# Altium project PCB_Project_IMX7.PrjPCB (part 4 of 9)

## Sheet IMX7S_WIRELESS.SchDoc
size A2
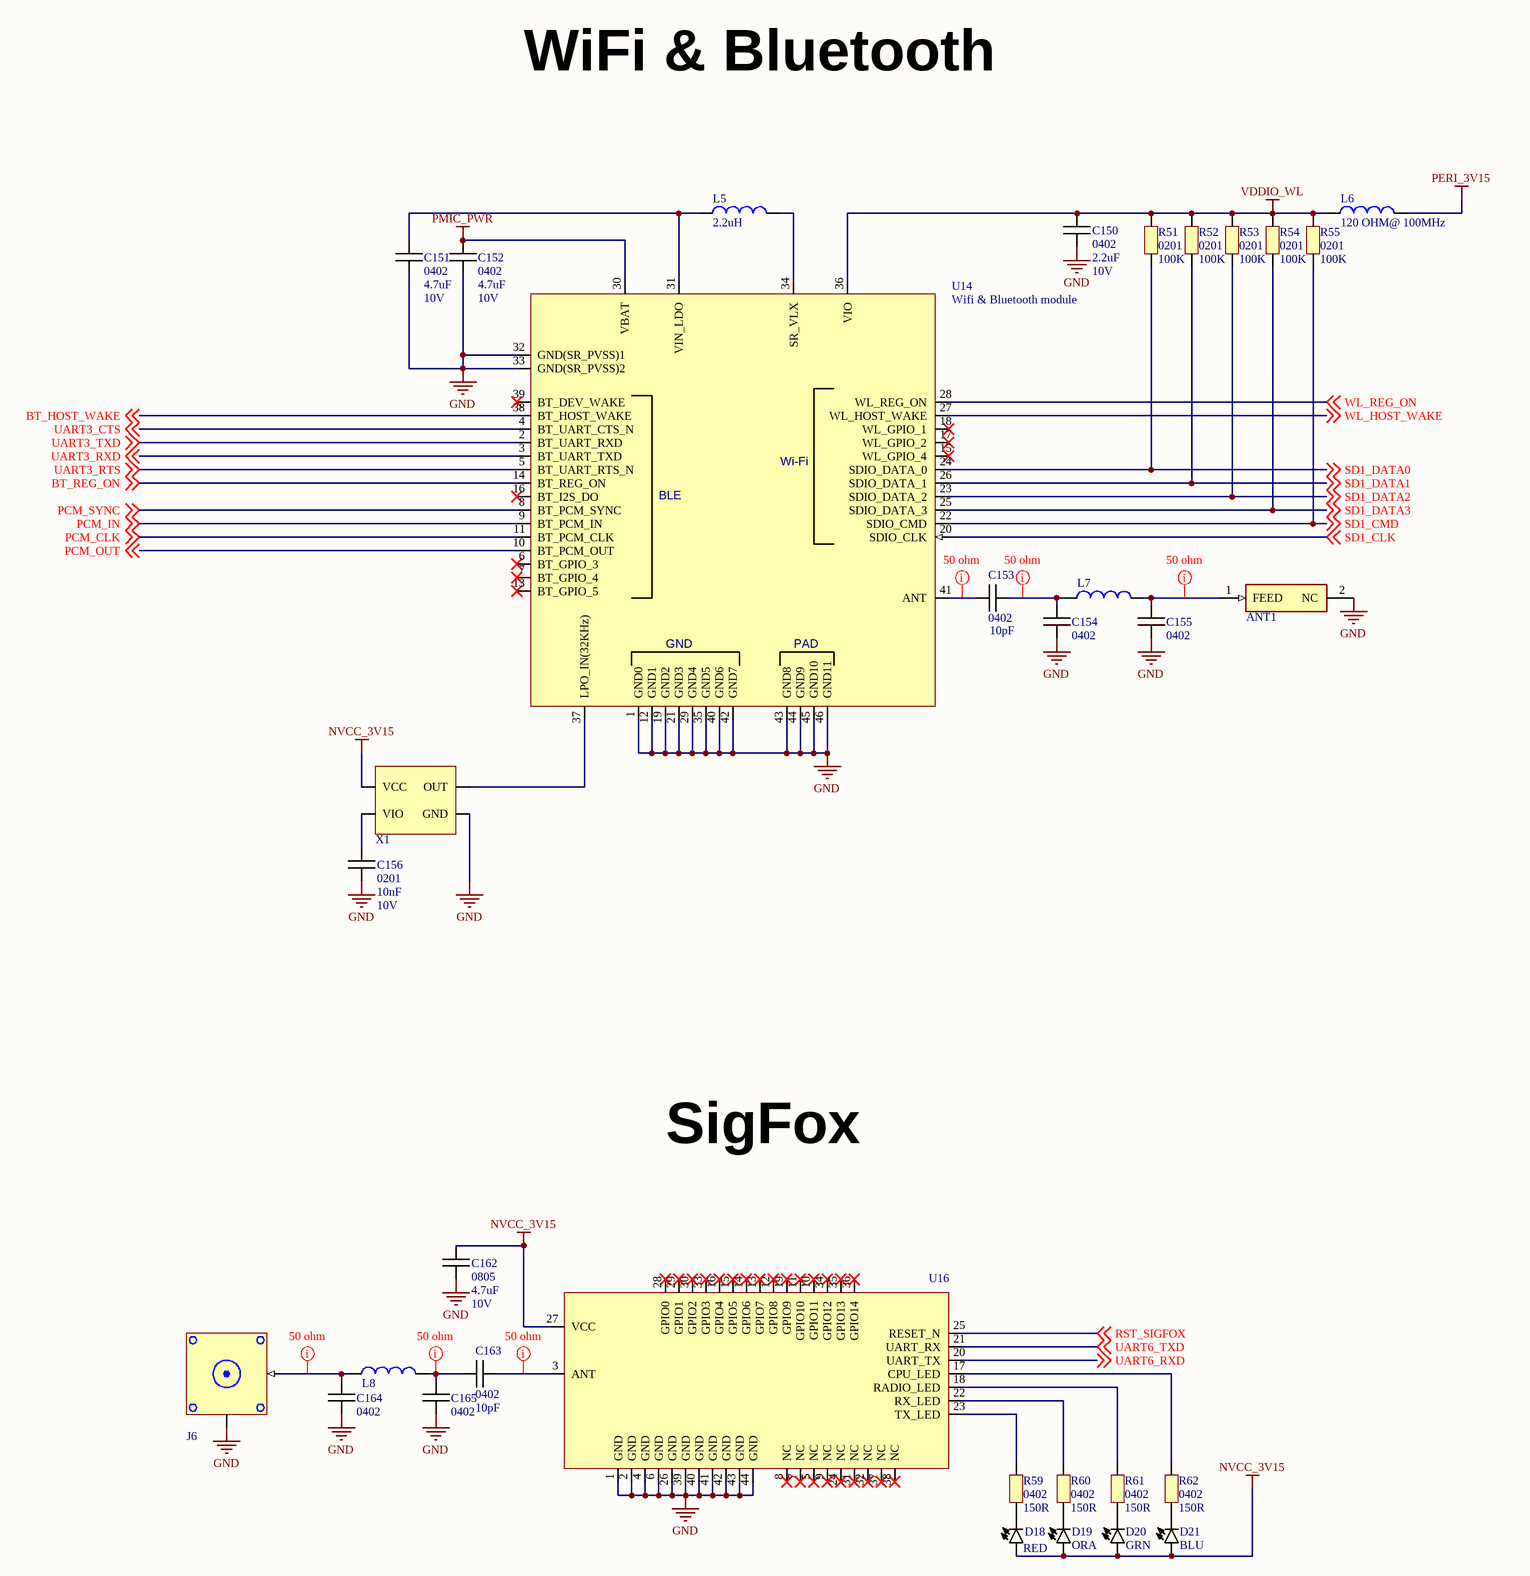
[diagram p6: IMX7S_WIRELESS.SchDoc]

### Parts
ANT1  SRCW004  [SRCW004]  (value not drawn)
C150  value 2.2uF  PACKAGE: 0402  VOLTAGE: 10V  [C0402]  (hidden comment: C0402)
C151  value 4.7uF  PACKAGE: 0402  VOLTAGE: 10V  [C0402]  (hidden comment: C0402)
C152  value 4.7uF  PACKAGE: 0402  VOLTAGE: 10V  [C0402]  (hidden comment: C0402)
C153  value 10pF  PACKAGE: 0402  [C0402]  (hidden comment: C0402)
C154  PACKAGE: 0402  [C0402]  (hidden comment: C0402)
C155  PACKAGE: 0402  [C0402]  (hidden comment: C0402)
C156  value 10nF  PACKAGE: 0201  VOLTAGE: 10V  [C0201]  (hidden comment: C0201)
C162  value 4.7uF  PACKAGE: 0805  VOLTAGE: 10V  [C0805]  (hidden comment: C0805)
C163  value 10pF  PACKAGE: 0402  [C0402]  (hidden comment: C0402)
C164  PACKAGE: 0402  [C0402]  (hidden comment: C0402)
C165  PACKAGE: 0402  [C0402]  (hidden comment: C0402)
D18  RED  [D0603]
D19  ORA  [D0603]
D20  GRN  [D0603]
D21  BLU  [D0603]
J6  SMA  [SMA]  (value not drawn)
L5  value 2.2uH  [R0402]  (hidden comment: Self)
L6  value 120 OHM@ 100MHz  [SELF]  (hidden comment: Self)
L7  Self  [R0402]  (value not drawn)
L8  Self  [R0402]  (value not drawn)
R51  value 100K  PACKAGE: 0201  [R0201]  (hidden comment: R0201)
R52  value 100K  PACKAGE: 0201  [R0201]  (hidden comment: R0201)
R53  value 100K  PACKAGE: 0201  [R0201]  (hidden comment: R0201)
R54  value 100K  PACKAGE: 0201  [R0201]  (hidden comment: R0201)
R55  value 100K  PACKAGE: 0201  [R0201]  (hidden comment: R0201)
R59  value 150R  PACKAGE: 0402  [R0402]  (hidden comment: R0402)
R60  value 150R  PACKAGE: 0402  [R0402]  (hidden comment: R0402)
R61  value 150R  PACKAGE: 0402  [R0402]  (hidden comment: R0402)
R62  value 150R  PACKAGE: 0402  [R0402]  (hidden comment: R0402)
U14  Wifi & Bluetooth module  [LBEE5KL1DX]
U16  AX-SIP-SFEU-1-01-TX30  [AX-SIP-SFEU-1-01-TX30]  (value not drawn)
X1  X1B0002110001 SG-3030CM 32.768KHZ B  [SPXO]  (value not drawn)

### Nets
GND: ANT1.2(NC) C150.1 C151.1 C152.1 C154.1 C155.1 C156.1 C162.1 C164.1 C165.1 J6.2(GND) U14.1(GND0) U14.12(GND1) U14.19(GND2) U14.21(GND3) U14.29(GND4) U14.32(GND(SR_PVSS)1) U14.33(GND(SR_PVSS)2) U14.35(GND5) U14.40(GND6) U14.42(GND7) U14.43(GND8) U14.44(GND9) U14.45(GND10) U14.46(GND11) U16.1(GND) U16.2(GND) U16.4(GND) U16.6(GND) U16.26(GND) U16.39(GND) U16.40(GND) U16.41(GND) U16.42(GND) U16.43(GND) U16.44(GND) X1.2(GND)
NVCC_3V15: C162.2 D18.1(A) D19.1(A) D20.1(A) D21.1(A) U16.27(VCC) X1.4(VCC)
PERI_3V15: L6.2
PMIC_PWR: C152.2 U14.30(VBAT)
VDDIO_WL: C150.2 L6.1 R51.2 R52.2 R53.2 R54.2 R55.2 U14.36(VIO)
BT_HOST_WAKE: U14.38(BT_HOST_WAKE) ; off-sheet BT_HOST_WAKE
BT_REG_ON: U14.14(BT_REG_ON) ; off-sheet BT_REG_ON
PCM_CLK: U14.11(BT_PCM_CLK) ; off-sheet PCM_CLK
PCM_IN: U14.9(BT_PCM_IN) ; off-sheet PCM_IN
PCM_OUT: U14.10(BT_PCM_OUT) ; off-sheet PCM_OUT
PCM_SYNC: U14.8(BT_PCM_SYNC) ; off-sheet PCM_SYNC
RST_SIGFOX: U16.25(RESET_N) ; off-sheet RST_SIGFOX
SD1_CLK: U14.20(SDIO_CLK) ; off-sheet SD1_CLK
SD1_CMD: R55.1 U14.22(SDIO_CMD) ; off-sheet SD1_CMD
SD1_DATA0: R51.1 U14.24(SDIO_DATA_0) ; off-sheet SD1_DATA0
SD1_DATA1: R52.1 U14.26(SDIO_DATA_1) ; off-sheet SD1_DATA1
SD1_DATA2: R53.1 U14.23(SDIO_DATA_2) ; off-sheet SD1_DATA2
SD1_DATA3: R54.1 U14.25(SDIO_DATA_3) ; off-sheet SD1_DATA3
UART3_CTS: U14.4(BT_UART_CTS_N) ; off-sheet UART3_CTS
UART3_RTS: U14.5(BT_UART_RTS_N) ; off-sheet UART3_RTS
UART3_RXD: U14.3(BT_UART_TXD) ; off-sheet UART3_RXD
UART3_TXD: U14.2(BT_UART_RXD) ; off-sheet UART3_TXD
UART6_RXD: U16.20(UART_TX) ; off-sheet UART6_RXD
UART6_TXD: U16.21(UART_RX) ; off-sheet UART6_TXD
WL_HOST_WAKE: U14.27(WL_HOST_WAKE) ; off-sheet WL_HOST_WAKE
WL_REG_ON: U14.28(WL_REG_ON) ; off-sheet WL_REG_ON
NetANT1_1: ANT1.1(FEED) C155.2 L7.2
NetC151_2: C151.2 L5.1 U14.31(VIN_LDO)
NetC153_1: C153.1 C154.2 L7.1
NetC153_2: C153.2 U14.41(ANT)
NetC156_2: C156.2 X1.1(VIO)
NetC163_1: C163.1 U16.3(ANT)
NetC163_2: C163.2 C165.2 L8.2
NetC164_2: C164.2 J6.1 L8.1
NetD18_2: D18.2(K) R59.1
NetD19_2: D19.2(K) R60.1
NetD20_2: D20.2(K) R61.1
NetD21_2: D21.2(K) R62.1
NetL5_2: L5.2 U14.34(SR_VLX)
NetR59_2: R59.2 U16.23(TX_LED)
NetR60_2: R60.2 U16.22(RX_LED)
NetR61_2: R61.2 U16.18(RADIO_LED)
NetR62_2: R62.2 U16.17(CPU_LED)
NetU14_37: U14.37(LPO_IN(32KHz)) X1.3(OUT)

Not connected (* = marked no-connect by the designer): U14 6(BT_GPIO_3)* 7(BT_GPIO_4)* 13(BT_GPIO_5)* 15(WL_GPIO_4)* 16(BT_I2S_DO)* 17(WL_GPIO_2)* 18(WL_GPIO_1)* 39(BT_DEV_WAKE)*; U16 5(NC)* 7(NC)* 8(NC)* 9(NC)* 10(GPIO11)* 11(GPIO10)* 12(GPIO8)* 13(GPIO7)* 14(GPIO6)* 15(GPIO5)* 16(GPIO4)* 19(GPIO9)* 24(NC)* 28(GPIO0)* 29(GPIO1)* 30(GPIO2)* 31(NC)* 32(NC)* 33(GPIO3)* 34(GPIO12)* 35(GPIO13)* 36(GPIO14)* 37(NC)* 38(NC)*

### Layout directives
rule Impedance Constraint [Min = 50.00    Max = 50.50    ]: NetANT1_1, NetC153_1, NetC153_2
mark named 50 ohm: NetC163_1, NetC163_2, NetC164_2

### Notes on the sheet
- WiFi & Bluetooth
- SigFox
- Title
- Size:
- Date:
- File:
- A2
- Number:
- Time:
- Revision:
- Sheet
- of
- (in symbol LBEE5KL1X-833) Wi-Fi; BLE; GND; PAD

### Library data of the parts
ANT1 = SRCW004: Antenna; Manufacturer_Name: Antenova; Datasheet Link: https://componentsearchengine.com/Datasheets/1/SRCW004.pdf; Manufacturer_Part_Number: SRCW004; Mouser Part Number: 237-SRCW004; Mouser Price/Stock: https://www.mouser.com/Search/Refine.aspx?Keyword=237-SRCW004
C150 = C0402: Manufacturer 1: Wurth Electronics; Manufacturer Part Number 1: 885012105013; Tolerance: 20%; Supplier 1: Farnell; Supplier Part Number 1: 2533930; Stock 1: 11802; Pricing 1: 10=0,21600, 100=0,14100, 500=0,10600, 2500=0,09320, 5000=0,07880, 10000=0,07420, 50000=0,06950 (EUR); RoHS: Yes; Mount: Surface Mount; Case/Package: 0402; Case Code (Metric): 1005; Case Code (Imperial): 0402; Min Operating Temperature: -55°C; Max Operating Temperature: 85°C; Packaging: Tape and Reel; Capacitance: 2.2uF; Voltage Rating: 10V; Length: 0.039inch; Width: 0.02inch; Thickness: 0.022inch; ComponentLink1URL: http://www.farnell.com/datasheets/2031748.pdf?src-supplier=Farnell; ComponentLink1Description: http://www.farnell.com/datasheets/2031748.pdf?src-supplier=Farnell; ComponentLink2URL: https://katalog.we-online.de/pbs/datasheet/885012105013.pdf?src-supplier=Digi-Key; ComponentLink2Description: https://katalog.we-online.de/pbs/datasheet/885012105013.pdf?src-supplier=Digi-Key
C151 C152 = C0402: Manufacturer 1: Murata; Manufacturer Part Number 1: GRM155R61A475MEAAD; Supplier 1: Farnell; Supplier Part Number 1: 2688503; Stock 1: 566816; Pricing 1: 10=0,19300, 100=0,08330, 500=0,05910, 2500=0,04130, 5000=0,03540, 10000=0,02750, 50000=0,02700 (EUR); Case/Package: 0402; ComponentLink1URL: http://www.farnell.com/datasheets/2189109.pdf?src-supplier=Farnell; ComponentLink1Description: http://www.farnell.com/datasheets/2189109.pdf?src-supplier=Farnell; ComponentLink2URL: https://search.murata.co.jp/Ceramy/image/img/A01X/G101/ENG/GRM155R61A475MEAA-01.pdf?src-supplier=Digi-Key; ComponentLink2Description: https://search.murata.co.jp/Ceramy/image/img/A01X/G101/ENG/GRM155R61A475MEAA-01.pdf?src-supplier=Digi-Key; ComponentLink3URL: http://datasheet.octopart.com/GRM155R61A475MEAAD-Murata-datasheet-68589269.pdf?src-supplier=Newark; ComponentLink3Description: http://datasheet.octopart.com/GRM155R61A475MEAAD-Murata-datasheet-68589269.pdf?src-supplier=Newark; ComponentLink4URL: http://datasheet.octopart.com/GRM155R61A475MEAAD-Murata-datasheet-8819587.pdf; ComponentLink4Description: http://datasheet.octopart.com/GRM155R61A475MEAAD-Murata-datasheet-8819587.pdf; ComponentLink5URL: http://datasheet.octopart.com/GRM155R61A475MEAAD-Murata-datasheet-10025737.pdf; ComponentLink5Description: http://datasheet.octopart.com/GRM155R61A475MEAAD-Murata-datasheet-10025737.pdf; ComponentLink6URL: http://datasheet.octopart.com/GRM155R61A475MEAAD-Murata-datasheet-11978611.pdf; ComponentLink6Description: http://datasheet.octopart.com/GRM155R61A475MEAAD-Murata-datasheet-11978611.pdf; ComponentLink7URL: http://datasheet.octopart.com/GRM155R61A475MEAAD-Murata-datasheet-12510076.pdf; ComponentLink7Description: http://datasheet.octopart.com/GRM155R61A475MEAAD-Murata-datasheet-12510076.pdf; ComponentLink8URL: http://datasheet.octopart.com/GRM155R61A475MEAAD-Murata-datasheet-12515295.pdf; ComponentLink8Description: http://datasheet.octopart.com/GRM155R61A475MEAAD-Murata-datasheet-12515295.pdf
C153 C163 = C0402: Manufacturer 1: Multicomp; Manufacturer Part Number 1: MCMT21N100F100CT; VOLTAGE: 0V; Tolerance: 1%; Voltage Rating: 10V; Dielectric: C0G; Temperature Coefficient: 30ppm/°C; Supplier 1: Farnell; Supplier Part Number 1: 1856178; Stock 1: 3419; Pricing 1: 10=0,17200, 100=0,10600, 500=0,06960, 1000=0,05940, 2000=0,04860, 4000=0,03920, 20000=0,03340, 40000=0,03010 (EUR); RoHS: Yes; Case/Package: 0805; Case Code (Metric): 2012; Case Code (Imperial): 0805; Min Operating Temperature: -55°C; Max Operating Temperature: 125°C; Capacitance: 10pF; Packaging: Cut Tape; Voltage Rating (DC): 10V; REACH SVHC: No SVHC; ComponentLink1URL: https://datasheet.ciiva.com/36855/1825496-36855401.pdf?src-supplier=Element14; ComponentLink1Description: https://datasheet.ciiva.com/36855/1825496-36855401.pdf?src-supplier=Element14; ComponentLink2URL: https://datasheet.ciiva.com/36858/876497-36858453.pdf?src-supplier=Element14; ComponentLink2Description: https://datasheet.ciiva.com/36858/876497-36858453.pdf?src-supplier=Element14
C154 C155 C164 C165 = C0402: VALUE: 0nF; VOLTAGE: 0V
C162 = C0805: Manufacturer 1: Walsin Technologies; Manufacturer Part Number 1: 0805X475K100CT; Description: Cap Ceramic 4.7uF 10V X5R 10% SMD 0805 85C Plastic T/R; Tolerance: 10%; Dielectric: X5R; Supplier 1: Farnell; Supplier Part Number 1: 2495555; Stock 1: 78000; Pricing 1: 3000=0,03050, 15000=0,02460, 30000=0,02410 (EUR); RoHS: Yes; Case/Package: 0805; Case Code (Metric): 2012; Case Code (Imperial): 0805; Min Operating Temperature: -55°C; Max Operating Temperature: 85°C; Capacitance: 4.7uF; Packaging: Tape and Reel; Voltage Rating: 10V; Voltage Rating (DC): 10V; Length: 2mm; Depth: 1.25mm; REACH SVHC: Unknown; Lead Free: Lead Free; ComponentLink1URL: http://www.farnell.com/datasheets/2340522.pdf?src-supplier=Farnell; ComponentLink1Description: http://www.farnell.com/datasheets/2340522.pdf?src-supplier=Farnell; ComponentLink2URL: http://www.farnell.com/datasheets/1958513.pdf?src-supplier=Farnell; ComponentLink2Description: http://www.farnell.com/datasheets/1958513.pdf?src-supplier=Farnell; ComponentLink3URL: http://components.arrow.com/part/dataview/0323_01911756?src-supplier=Arrow+Europe; ComponentLink3Description: http://components.arrow.com/part/dataview/0323_01911756?src-supplier=Arrow+Europe; ComponentLink4URL: http://www.farnell.com/datasheets/1958513.pdf?src-supplier=Element14; ComponentLink4Description: http://www.farnell.com/datasheets/1958513.pdf?src-supplier=Element14
D18 = LED: Manufacturer 1: Broadcom Avago; Manufacturer Part Number 1: HSMC-C190; Lens Color: White; Luminous Intensity: 90mcd; Viewing Angle: 170°; Forward Voltage: 1.9V; Wavelength: 626nm; Lens Style: Rectangular,Diffused,Colorless; Power Dissipation: 60mW; Forward Current: 20mA; Lens Transparency: Diffused; Number of Elements: 1; Reverse Voltage: 5V; Supplier 1: Farnell; Supplier Part Number 1: 8554510; Stock 1: 2742; Pricing 1: 5=0,33400, 25=0,31900, 100=0,17100, 250=0,16900, 500=0,14000, 1000=0,11000 (EUR); RoHS: Yes; Mount: Surface Mount; Case/Package: 0603; Number of Pins: 2; Color: Red; Case Code (Metric): 1608; Case Code (Imperial): 0603; Min Operating Temperature: -40°C; Max Operating Temperature: 85°C; Packaging: Tape and Reel; Voltage Rating (DC): 1.9V; Package Quantity: 1; Illumination Color: Red; Power Rating: 60mW; Dominant Wavelength: 626nm; Test Current: 20mA; Max Power Dissipation: 60mW; Number of LEDs: 1; Length: 1.6mm; Height: 0.8mm; Width: 0.8mm; Depth: 0.8mm; Radiation Hardening: No; REACH SVHC: No SVHC; Lead Free: Lead Free; ComponentLink1URL: https://datasheet.ciiva.com/15117/getdatasheetpartid-128083-15117636.pdf?src-supplier=Verical; ComponentLink1Description: https://datasheet.ciiva.com/15117/getdatasheetpartid-128083-15117636.pdf?src-supplier=Verical; ComponentLink2URL: https://datasheet.ciiva.com/11774/0900766b80db8814-11774600.pdf?src-supplier=RSComponents; ComponentLink2Description: https://datasheet.ciiva.com/11774/0900766b80db8814-11774600.pdf?src-supplier=RSComponents; ComponentLink3URL: https://datasheet.ciiva.com/29280/180490-da-01-en-chip-led-hsmc-c190-rot-29280952.pdf?src-supplier=Conrad; ComponentLink3Description: https://datasheet.ciiva.com/29280/180490-da-01-en-chip-led-hsmc-c190-rot-29280952.pdf?src-supplier=Conrad; ComponentLink4URL: https://datasheet.ciiva.com/48430/hsmx-c110-170-190-191-150-eng-tds-48430137.pdf?src-supplier=Distrelec; ComponentLink4Description: https://datasheet.ciiva.com/48430/hsmx-c110-170-190-191-150-eng-tds-48430137.pdf?src-supplier=Distrelec; ComponentLink5URL: https://datasheet.ciiva.com/22656/55913-22656556.pdf?src-supplier=Element14; ComponentLink5Description: https://datasheet.ciiva.com/22656/55913-22656556.pdf?src-supplier=Element14; ComponentLink6URL: https://datasheet.ciiva.com/22656/55913-22656557.pdf?src-supplier=Element14; ComponentLink6Description: https://datasheet.ciiva.com/22656/55913-22656557.pdf?src-supplier=Element14
D19 = LED: Manufacturer 1: Broadcom; Manufacturer Part Number 1: HSMD-C190; Color: Orange; Lens Color: White; Wavelength: 604nm; Forward Voltage: 2.2V; Luminous Intensity: 8mcd; Viewing Angle: 170°; Lens Transparency: Diffused; Test Current: 20mA; Lens Style: Rectangular; Power Dissipation: 52mW; Supplier 1: Farnell; Supplier Part Number 1: 8554552; Stock 1: 1930; Pricing 1: 5=0,30200, 25=0,29000, 100=0,12400, 250=0,11700, 500=0,09340, 1000=0,06930 (EUR); RoHS: Yes; Mount: Surface Mount; Case/Package: 0603; Number of Pins: 2; Case Code (Metric): 1608; Case Code (Imperial): 0603; Packaging: Tape and Reel; Dominant Wavelength: 604nm; Forward Current: 20mA; Voltage Rating (DC): 2.2V; Length: 1.6mm; Height: 0.8mm; Width: 0.8mm; REACH SVHC: No SVHC; Lead Free: Lead Free; ComponentLink1URL: https://media.digikey.com/pdf/Data%20Sheets/Avago%20PDFs/HSMz-Czzz.pdf?src-supplier=Digi-Key; ComponentLink1Description: https://media.digikey.com/pdf/Data%20Sheets/Avago%20PDFs/HSMz-Czzz.pdf?src-supplier=Digi-Key; ComponentLink2URL: https://www.distrelec.biz/Web/Downloads/90/_e/swSerieHSMx-C150toC190_e.pdf?mime=application%2Fpdf&src-supplier=Distrelec; ComponentLink2Description: https://www.distrelec.biz/Web/Downloads/90/_e/swSerieHSMx-C150toC190_e.pdf?mime=application%2Fpdf&src-supplier=Distrelec; ComponentLink3URL: http://www.farnell.com/datasheets/1681524.pdf?src-supplier=Farnell; ComponentLink3Description: http://www.farnell.com/datasheets/1681524.pdf?src-supplier=Farnell; ComponentLink4URL: http://www.farnell.com/datasheets/1681524.pdf?src-supplier=Element14; ComponentLink4Description: http://www.farnell.com/datasheets/1681524.pdf?src-supplier=Element14
D20 = LED: Manufacturer 1: Dialight; Manufacturer Part Number 1: 598-8081-107F; Color: Green; Lens Color: Colorless,Clear; Viewing Angle: 140°; Lens Style: Rectangular,Diffused,Colorless,Flat,Clear; Wavelength: 525nm; Luminous Intensity: 300mcd; Forward Voltage: 3.2V; Forward Current: 20mA; Reverse Breakdown Voltage: 5V; Lens Transparency: Clear; Dominant Wavelength: 523nm; Number of Elements: 1; Power Dissipation: 70mW; Supplier 1: Digi-Key; Supplier Part Number 1: 350-2036-1-ND; Stock 1: 39068; Pricing 1: 1=0,81000, 10=0,63100, 100=0,40570, 500=0,34258, 1000=0,27046 (USD); RoHS: Yes; Mount: Surface Mount; Case/Package: 0603; Number of Pins: 2; Case Code (Metric): 1608; Case Code (Imperial): 0603; Contact Plating: Gold; Min Operating Temperature: -30°C; Max Operating Temperature: 85°C; Package Quantity: 4000; Packaging: Tape and Reel; Illumination Color: Green; Test Current: 20mA; Max Power Dissipation: 70mW; Number of LEDs: 1; Reverse Voltage: 5V; Length: 1.6mm; Height: 0.7mm; Width: 0.8mm; Depth: 0.8mm; Radiation Hardening: No; REACH SVHC: No SVHC; Lead Free: Lead Free; ComponentLink1URL: https://datasheet.ciiva.com/2111/598-series-0603-pkg-2111650.pdf?src-supplier=Digi-Key; ComponentLink1Description: https://datasheet.ciiva.com/2111/598-series-0603-pkg-2111650.pdf?src-supplier=Digi-Key; ComponentLink2URL: https://datasheet.ciiva.com/2111/598-series-0603-pkg-2111651.pdf?src-supplier=Digi-Key; ComponentLink2Description: https://datasheet.ciiva.com/2111/598-series-0603-pkg-2111651.pdf?src-supplier=Digi-Key; ComponentLink3URL: https://datasheet.ciiva.com/2111/598-series-0603-pkg-2111652.pdf?src-supplier=Digi-Key; ComponentLink3Description: https://datasheet.ciiva.com/2111/598-series-0603-pkg-2111652.pdf?src-supplier=Digi-Key; ComponentLink4URL: https://datasheet.ciiva.com/14605/70081991-14605333.pdf?src-supplier=Allied+Electronics; ComponentLink4Description: https://datasheet.ciiva.com/14605/70081991-14605333.pdf?src-supplier=Allied+Electronics; ComponentLink5URL: https://datasheet.ciiva.com/15965/mdei5980603-15965385.pdf?src-supplier=Onlinecomponents.com; ComponentLink5Description: https://datasheet.ciiva.com/15965/mdei5980603-15965385.pdf?src-supplier=Onlinecomponents.com; ComponentLink6URL: https://datasheet.ciiva.com/4689/smt-selector-guide-267443-4689308.pdf?src-supplier=Mouser; ComponentLink6Description: https://datasheet.ciiva.com/4689/smt-selector-guide-267443-4689308.pdf?src-supplier=Mouser; ComponentLink7URL: https://datasheet.ciiva.com/30221/mdei5980603-30221820.pdf?src-supplier=Onlinecomponents.com; ComponentLink7Description: https://datasheet.ciiva.com/30221/mdei5980603-30221820.pdf?src-supplier=Onlinecomponents.com; ComponentLink8URL: https://datasheet.ciiva.com/16394/smt-selector-guide-16394078.pdf?src-supplier=Future+Electronics; ComponentLink8Description: https://datasheet.ciiva.com/16394/smt-selector-guide-16394078.pdf?src-supplier=Future+Electronics
D21 = LED: Manufacturer 1: Broadcom; Manufacturer Part Number 1: HSMR-C190; Color: Blue; Lens Color: White; Wavelength: 473nm; Forward Voltage: 3.4V; Luminous Intensity: 55mcd; Viewing Angle: 155°; Lens Style: Rectangular; Lens Transparency: Diffused; Test Current: 20mA; Supplier 1: Farnell; Supplier Part Number 1: 1652108; Stock 1: 9745; Pricing 1: 5=0,80800, 10=0,50500, 25=0,47900, 50=0,45300, 100=0,29700, 500=0,23000 (EUR); RoHS: Yes; Mount: Surface Mount; Case/Package: 0603; Case Code (Metric): 1608; Case Code (Imperial): 0603; Packaging: Cut Tape; Dominant Wavelength: 473nm; Forward Current: 20mA; Length: 1.6mm; Height: 0.8mm; Width: 0.8mm; REACH SVHC: No SVHC; ComponentLink1URL: http://www.farnell.com/datasheets/612861.pdf?src-supplier=Farnell; ComponentLink1Description: http://www.farnell.com/datasheets/612861.pdf?src-supplier=Farnell; ComponentLink2URL: http://www.farnell.com/datasheets/612861.pdf?src-supplier=Element14; ComponentLink2Description: http://www.farnell.com/datasheets/612861.pdf?src-supplier=Element14; ComponentLink3URL: https://docs.broadcom.com/docs/AV00-0244EN?src-supplier=Digi-Key; ComponentLink3Description: https://docs.broadcom.com/docs/AV00-0244EN?src-supplier=Digi-Key
L7 L8 = Self: Value: 0uH
R51-R55 = R0201: Manufacturer 1: Multicomp; Manufacturer Part Number 1: MCRE000188; VOLTAGE: 0V; Description: MULTICOMP - MCRE000188 - RES, 100K, 1%, 0.05W, 0201, THICK FILM; Voltage Rating (DC): 25V; Resistance: 100kR; Power Rating: 50mW; Tolerance: 1%; Temperature Coefficient: 200ppm/°C; Supplier 1: Farnell; Supplier Part Number 1: 2130095; Stock 1: 105000; Pricing 1: 15000=0,00320, 75000=0,00290, 150000=0,00260 (EUR); RoHS: Yes; Case/Package: SMD/SMT; Case Code (Metric): 0603; Case Code (Imperial): 0201; Min Operating Temperature: -55°C; Max Operating Temperature: 125°C; Packaging: Tape and Reel; Voltage Rating: 25V; Composition: Thick Film; Width: 0.6mm; REACH SVHC: No SVHC; ComponentLink1URL: https://datasheet.ciiva.com/22752/1636793-22752042.pdf?src-supplier=Element14; ComponentLink1Description: https://datasheet.ciiva.com/22752/1636793-22752042.pdf?src-supplier=Element14
R59-R62 = R0402: Manufacturer 1: TE Connectivity; Manufacturer Part Number 1: CRG0402F150R; VOLTAGE: 0V; Description: TE Connectivity CRG0402 Series Thick Film Surface Mount Resistor 0402 Case 150 1% 0.063W 100ppm/C; Power Rating: 63mW; Tolerance: 1%; Voltage Rating: 50V; Temperature Coefficient: 100ppm/°C; Number of Resistors: 1; Supplier 1: Farnell; Supplier Part Number 1: 2331461; Stock 1: 726007; Pricing 1: 10=0,00680, 100=0,00580, 500=0,00510, 2500=0,00410, 5000=0,00360, 10000=0,00320, 50000=0,00260 (EUR); RoHS: Yes; Mount: Surface Mount; Case/Package: 0402; Case Code (Imperial): 0402; Case Code (Metric): 1005; Min Operating Temperature: -55°C; Max Operating Temperature: 125°C; Termination: Solder; Resistance: 150R; Packaging: Tape and Reel; Composition: Thick Film; Voltage Rating (DC): 50V; Number of Terminations: 2; Length: 1mm; Height: 0.35mm; Width: 0.5mm; Depth: 0.5mm; REACH SVHC: No SVHC; ELV: Compliant; ComponentLink1URL: https://datasheet.ciiva.com/11811/0900766b80d0914d-11811549.pdf?src-supplier=RSComponents; ComponentLink1Description: https://datasheet.ciiva.com/11811/0900766b80d0914d-11811549.pdf?src-supplier=RSComponents; ComponentLink2URL: https://datasheet.ciiva.com/22706/1610603-22706057.pdf?src-supplier=Element14; ComponentLink2Description: https://datasheet.ciiva.com/22706/1610603-22706057.pdf?src-supplier=Element14; ComponentLink3URL: https://datasheet.ciiva.com/12564/eng-ds-1773204-g-12564442.pdf?src-supplier=Mouser; ComponentLink3Description: https://datasheet.ciiva.com/12564/eng-ds-1773204-g-12564442.pdf?src-supplier=Mouser; ComponentLink4URL: https://datasheet.ciiva.com/17122/70063020-17122731.pdf?src-supplier=Allied+Electronics; ComponentLink4Description: https://datasheet.ciiva.com/17122/70063020-17122731.pdf?src-supplier=Allied+Electronics; ComponentLink5URL: https://datasheet.ciiva.com/46386/1610603-46386107.pdf?src-supplier=Element14; ComponentLink5Description: https://datasheet.ciiva.com/46386/1610603-46386107.pdf?src-supplier=Element14
U14 = LBEE5KL1X-833: Supplier 1: Mouser; Supplier Part Number 1: 81-LBEE5KL1DX-883
U16 = AX-SIP-SFEU-1-01-TX30: Manufacturer 1: ON Semiconductor; Supplier 1: Farnell; Supplier Part Number 1: 2944317; Manufacturer Part Number 1: AX-SIP-SFEU-1-01-TX30; Stock 1: 9; Pricing 1: 1=11,32000, 5=10,81000, 10=9,53000, 50=8,96000, 100=8,39000, 250=6,85000 (EUR); RoHS: No
X1 = Oscillateur